# Altium project SmartMeter-new.PrjPCB (part 2 of 2)

## Sheet Sheet2-new.SchDoc: SMART METER Main Board
size A3; SheetNumber: 2
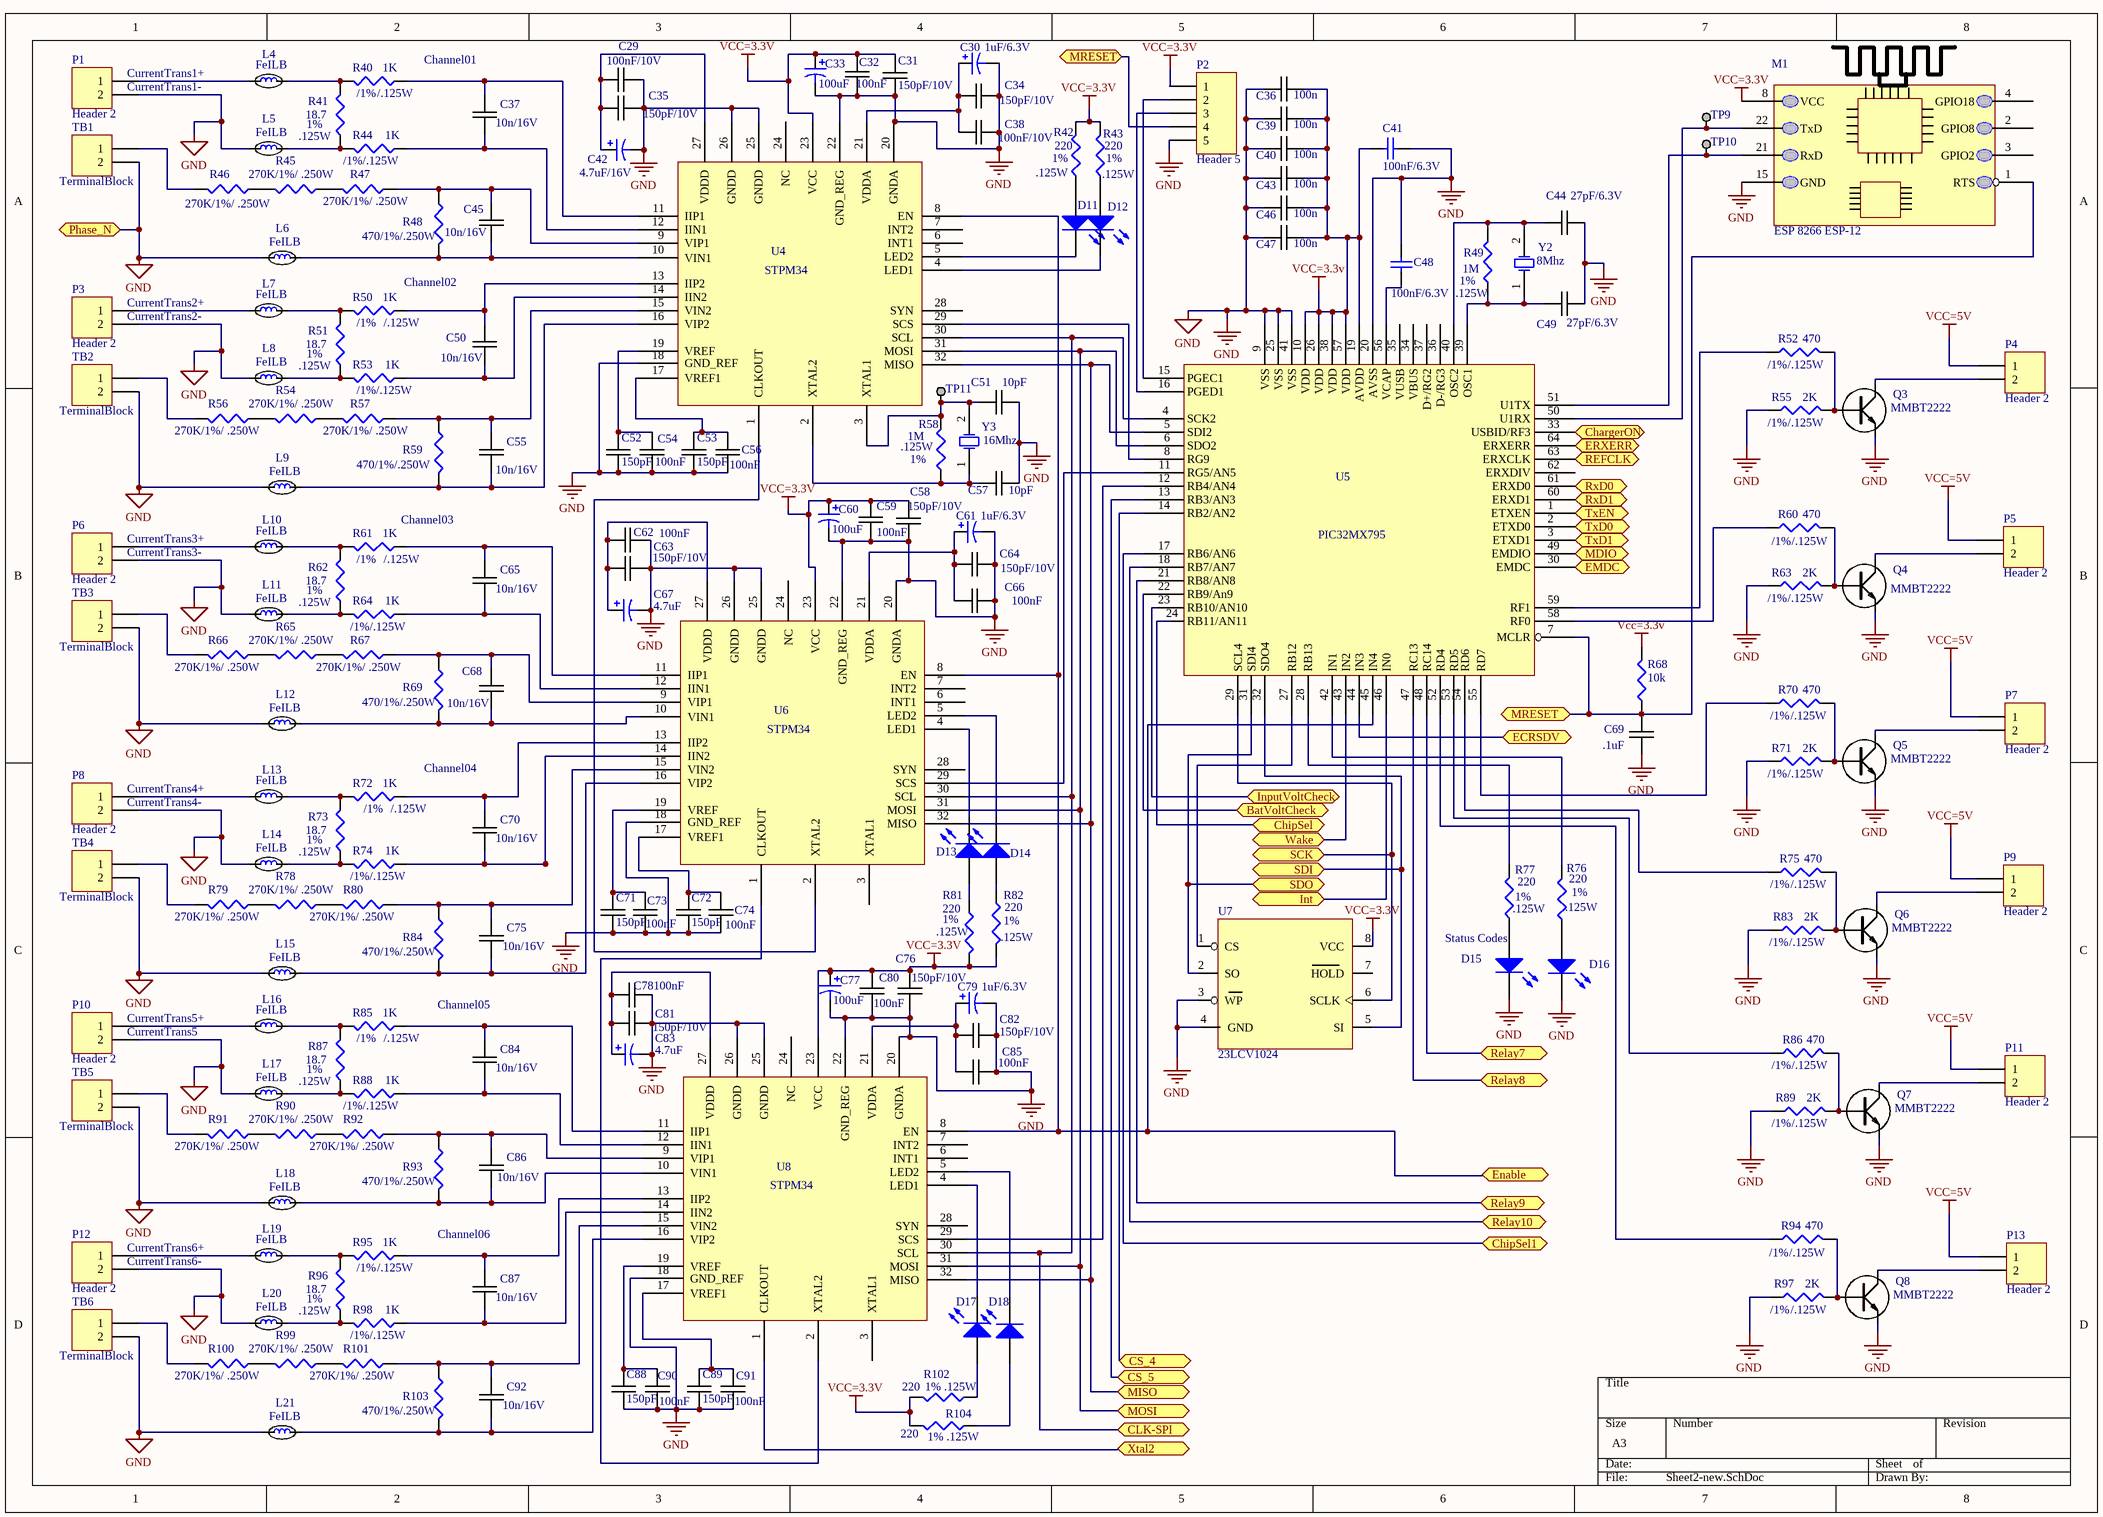
[diagram p1: Sheet2-new.SchDoc]

### Parts
C29  100nF/10V  [0402C-GENERIC]
C30  1uF/6.3V  [0402C-GENERIC]
C31  150pF/10V  [0402C-GENERIC]
C32  100nF  [0402C-GENERIC]
C33  100uF  [100uF/10V]
C34  150pF/10V  [0402C-GENERIC]
C35  150pF/10V  [0402C-GENERIC]
C36  100n  [0805C-TBD]
C37  10n/16V  [0402C-GENERIC]
C38  100nF/10V  [0402C-GENERIC]
C39  100n  [0805C-TBD]
C40  100n  [0805C-TBD]
C41  100nF/6.3V  [0805C-GENERIC]
C42  4.7uF/16V  [0805C-GENERIC]
C43  100n  [0805C-TBD]
C44  27pF/6.3V  [0603C-TBD]
C45  10n/16V  [0402C-GENERIC]
C46  100n  [0805C-TBD]
C47  100n  [0805C-TBD]
C48  100nF/6.3V  [0805C-GENERIC]
C49  27pF/6.3V  [0603C-TBD]
C50  10n/16V  [0402C-GENERIC]
C51  10pF  [0805C-TBD]
C52  150pF  [0402C-GENERIC]
C53  150pF  [0402C-GENERIC]
C54  100nF  [0402C-GENERIC]
C55  10n/16V  [0402C-GENERIC]
C56  100nF  [0402C-GENERIC]
C57  10pF  [0805C-TBD]
C58  150pF/10V  [0402C-GENERIC]
C59  100nF  [0402C-GENERIC]
C60  100uF  [100uF/10V]
C61  1uF/6.3V  [0402C-GENERIC]
C62  100nF  [0402C-GENERIC]
C63  150pF/10V  [0402C-GENERIC]
C64  150pF/10V  [0402C-GENERIC]
C65  10n/16V  [0402C-GENERIC]
C66  100nF  [0402C-GENERIC]
C67  4.7uF  [0805C-GENERIC]
C68  10n/16V  [0402C-GENERIC]
C69  .1uF  [0805C-TBD]
C70  10n/16V  [0402C-GENERIC]
C71  150pF  [0402C-GENERIC]
C72  150pF  [0402C-GENERIC]
C73  100nF  [0402C-GENERIC]
C74  100nF  [0402C-GENERIC]
C75  10n/16V  [0402C-GENERIC]
C76  150pF/10V  [0402C-GENERIC]
C77  100uF  [100uF/10V]
C78  100nF  [0402C-GENERIC]
C79  1uF/6.3V  [0402C-GENERIC]
C80  100nF  [0402C-GENERIC]
C81  150pF/10V  [0402C-GENERIC]
C82  150pF/10V  [0402C-GENERIC]
C83  4.7uF  [0805C-GENERIC]
C84  10n/16V  [0402C-GENERIC]
C85  100nF  [0402C-GENERIC]
C86  10n/16V  [0402C-GENERIC]
C87  10n/16V  [0402C-GENERIC]
C88  150pF  [0402C-GENERIC]
C89  150pF  [0402C-GENERIC]
C90  100nF  [0402C-GENERIC]
C91  100nF  [0402C-GENERIC]
C92  10n/16V  [0402C-GENERIC]
D11  LED2  [LED-SM]  (value not drawn)
D12  LED2  [LED-SM]  (value not drawn)
D13  LED2  [LED-SM]  (value not drawn)
D14  LED2  [LED-SM]  (value not drawn)
D15  LED2  [LED-SM]  (value not drawn)
D16  LED2  [LED-SM]  (value not drawn)
D17  LED2  [LED-SM]  (value not drawn)
D18  LED2  [LED-SM]  (value not drawn)
L4  FeILB  [0603C-TBD]
L5  FeILB  [0603C-TBD]
L6  FeILB  [0603C-TBD]
L7  FeILB  [0603C-TBD]
L8  FeILB  [0603C-TBD]
L9  FeILB  [0603R-0R]
L10  FeILB  [0603R-0R]
L11  FeILB  [0603C-TBD]
L12  FeILB  [0603R-0R]
L13  FeILB  [0603R-0R]
L14  FeILB  [0603C-TBD]
L15  FeILB  [0603C-TBD]
L16  FeILB  [0603C-TBD]
L17  FeILB  [0603R-0R]
L18  FeILB  [0603C-TBD]
L19  FeILB  [0603C-TBD]
L20  FeILB  [0603R-0R]
L21  FeILB  [0603C-TBD]
M1  ESP 8266 ESP-12  [PCBComponent_1 - duplicate]
P1  Header 2  [BG090-header]
P2  Header 5  [HDR1X5]
P3  Header 2  [BG090-header]
P4  Header 2  [BG090-header]
P5  Header 2  [BG090-header]
P6  Header 2  [BG090-header]
P7  Header 2  [BG090-header]
P8  Header 2  [BG090-header]
P9  Header 2  [BG090-header]
P10  Header 2  [BG090-header]
P11  Header 2  [BG090-header]
P12  Header 2  [BG090-header]
P13  Header 2  [BG090-header]
Q3  MMBT2222  [MMBT2222]
Q4  MMBT2222  [MMBT2222]
Q5  MMBT2222  [MMBT2222]
Q6  MMBT2222  [MMBT2222]
Q7  MMBT2222  [MMBT2222]
Q8  MMBT2222  [MMBT2222]
R40  1K  [0805C-GENERIC]
R41  18.7  [0805R-10]
R42  220  [0805C-GENERIC]
R43  220  [0805C-GENERIC]
R44  1K  [0805C-GENERIC]
R45  270K/1%/ .250W  [1210R-GENERIC]
R46  270K/1%/ .250W  [1210R-GENERIC]
R47  270K/1%/ .250W  [1210R-GENERIC]
R48  470/1%/.250W  [1206FB-GENERIC]
R49  1M  [0805R-12]
R50  1K  [0805C-GENERIC]
R51  18.7  [0805R-10]
R52  470  [0805R-39]
R53  1K  [0805C-GENERIC]
R54  270K/1%/ .250W  [1210R-GENERIC]
R55  2K  [0805R-180]
R56  270K/1%/ .250W  [1210R-GENERIC]
R57  270K/1%/ .250W  [1210R-GENERIC]
R58  1M  [0805FB-GENERIC]
R59  470/1%/.250W  [1206FB-GENERIC]
R60  470  [0805R-39]
R61  1K  [0805C-GENERIC]
R62  18.7  [0805R-10]
R63  2K  [0805R-180]
R64  1K  [0805C-GENERIC]
R65  270K/1%/ .250W  [1210R-GENERIC]
R66  270K/1%/ .250W  [1210R-GENERIC]
R67  270K/1%/ .250W  [1210R-GENERIC]
R68  10k  [0805R-27]
R69  470/1%/.250W  [1206FB-GENERIC]
R70  470  [0805R-39]
R71  2K  [0805R-180]
R72  1K  [0805C-GENERIC]
R73  18.7  [0805R-10]
R74  1K  [0805C-GENERIC]
R75  470  [0805R-39]
R76  220  [0805R-120]
R77  220  [0805R-12]
R78  270K/1%/ .250W  [1210R-GENERIC]
R79  270K/1%/ .250W  [1210R-GENERIC]
R80  270K/1%/ .250W  [1210R-GENERIC]
R81  220  [0805R-10]
R82  220  [0805R-10]
R83  2K  [0805R-180]
R84  470/1%/.250W  [1206FB-GENERIC]
R85  1K  [0805C-GENERIC]
R86  470  [0805R-39]
R87  18.7  [0805R-10]
R88  1K  [0805C-GENERIC]
R89  2K  [0805R-180]
R90  270K/1%/ .250W  [1210R-GENERIC]
R91  270K/1%/ .250W  [1210R-GENERIC]
R92  270K/1%/ .250W  [1210R-GENERIC]
R93  470/1%/.250W  [1206FB-GENERIC]
R94  470  [0805R-39]
R95  1K  [0805C-GENERIC]
R96  18.7  [0805R-10]
R97  2K  [0805R-180]
R98  1K  [0805C-GENERIC]
R99  270K/1%/ .250W  [1210R-GENERIC]
R100  270K/1%/ .250W  [1210R-GENERIC]
R101  270K/1%/ .250W  [1210R-GENERIC]
R102  220  [0805R-10]
R103  470/1%/.250W  [1206FB-GENERIC]
R104  220  [0805R-10]
TB1  TerminalBlock  [Terminal Block 2x5mm]
TB2  TerminalBlock  [Terminal Block 2x5mm]
TB3  TerminalBlock  [Terminal Block 2x5mm]
TB4  TerminalBlock  [Terminal Block 2x5mm]
TB5  TerminalBlock  [Terminal Block 2x5mm]
TB6  TerminalBlock  [Terminal Block 2x5mm]
TP9  TESTPOINT  [TESTPOINT]  (value not drawn)
TP10  TESTPOINT  [TESTPOINT]  (value not drawn)
TP11  TESTPOINT  [TESTPOINT]  (value not drawn)
U4  STPM34  [32M1-A_L]
U5  PIC32MX795  [TQFP-PT64_N]
U6  STPM34  [32M1-A_L]
U7  23LCV1024  [SO8_L]
U8  STPM34  [32M1-A_L]
Y2  8Mhz  [CeramicResonator8-16MHZ]
Y3  16Mhz  [CeramicResonator8-16MHZ]

### Ports
BatVoltCheck, ChargerON, ChipSel, ChipSel1, CLK-SPI, CS_4, CS_5, ECRSDV, EMDC, Enable, ERXERR, InputVoltCheck, Int, MDIO, MISO, MOSI, MRESET, Phase_N, REFCLK, Relay7, Relay8, Relay9, Relay10, RxD0, RxD1, SCK, SDI, SDO, TxD0, TxD1, TxEN, Wake, Xtal2

### Nets
GND: C29.1 C30.2 C31.2 C32.2 C33.2 C34.2 C35.2 C36.2 C38.1 C39.2 C40.2 C41.2 C42.2 C43.2 C44.2 C46.2 C47.2 C48.2 C49.2 C51.2 C52.2 C53.2 C54.2 C56.2 C57.2 C58.2 C59.1 C60.2 C61.2 C62.2 C63.2 C64.2 C66.2 C67.2 C69.1 C71.2 C72.2 C73.2 C74.1 C76.2 C77.2 C78.2 C79.2 C80.2 C81.2 C82.2 C83.2 C85.2 C88.2 C89.2 C90.2 C91.2 D15.2(K) D16.2(K) L5.1 L6.1 L8.1 L9.1 L11.1 L12.1 L14.1 L15.1 L17.1 L18.1 L20.1 L21.1 M1.15(GND) P1.2 P2.5 P3.2 P6.2 P8.2 P10.2 P12.2 Q3.E Q4.E Q5.E Q6.E Q7.E Q8.E R55.1 R63.1 R71.1 R83.1 R89.1 R97.1 TB1.2 TB2.2 TB3.2 TB4.2 TB5.2 TB6.2 U4.18(GND_REF) U4.20(GNDA) U4.22(GND_REG) U4.25(GNDD) U4.26(GNDD) U5.9(VSS) U5.20(AVSS) U5.25(VSS) U5.41(VSS) U6.18(GND_REF) U6.20(GNDA) U6.22(GND_REG) U6.25(GNDD) U6.26(GNDD) U7.3(WP) U7.4(GND) U8.18(GND_REF) U8.20(GNDA) U8.22(GND_REG) U8.25(GNDD) U8.26(GNDD) ; port Phase_N
VCC=3.3V: C31.1 C32.1 C33.1 C36.1 C39.1 C40.1 C41.1 C43.1 C46.1 C47.1 C58.1 C59.2 C60.1 C76.1 C77.1 C80.1 M1.8(VCC) P2.1 R42.2 R43.2 R68.2 R81.2 R82.2 R102.2 R104.2 U4.23(VCC) U5.10(VDD) U5.19(AVDD) U5.26(VDD) U5.38(VDD) U5.57(VDD) U6.23(VCC) U7.8(VCC) U8.23(VCC)
VCC=5V: P4.1 P5.1 P7.1 P9.1 P11.1 P13.1
NetC29_2: C29.2 C35.1 C42.1 U4.27(VDDD)
NetC30_1: C30.1 C34.1 C38.2 U4.21(VDDA)
NetC37_1: C37.1 R44.1 U4.12(IIN1)
NetC37_2: C37.2 R40.1 U4.11(IIP1)
NetC44_1: C44.1 R49.2 U5.40(OSC2) Y2.2(OSC2)
NetC45_1: C45.1 L6.2 R48.2 U4.10(VIN1)
NetC45_2: C45.2 R47.1 R48.1 U4.9(VIP1)
NetC48_1: C48.1 U5.56(VCAP)
NetC49_1: C49.1 R49.1 U5.39(OSC1) Y2.1(OSC1)
NetC50_1: C50.1 R53.1 U4.14(IIN2)
NetC50_2: C50.2 R50.1 U4.13(IIP2)
NetC51_1: C51.1 R58.2 TP11.1 U4.3(XTAL1) Y3.2(OSC2)
NetC52_1: C52.1 C54.1 U4.19(VREF)
NetC53_1: C53.1 C56.1 U4.17(VREF1)
NetC55_1: C55.1 L9.2 R59.2 U4.16(VIP2)
NetC55_2: C55.2 R57.1 R59.1 U4.15(VIN2)
NetC57_1: C57.1 R58.1 U4.2(XTAL2) Y3.1(OSC1)
NetC61_1: C61.1 C64.1 C66.1 U6.21(VDDA)
NetC62_1: C62.1 C63.1 C67.1 U6.27(VDDD)
NetC65_1: C65.1 R64.1 U6.12(IIN1)
NetC65_2: C65.2 R61.1 U6.11(IIP1)
NetC68_1: C68.1 L12.2 R69.2 U6.10(VIN1)
NetC68_2: C68.2 R67.1 R69.1 U6.9(VIP1)
NetC69_2: C69.2 M1.1(RTS) P2.4 R68.1 U5.7(MCLR) ; port MRESET
NetC70_1: C70.1 R74.1 U6.14(IIN2)
NetC70_2: C70.2 R72.1 U6.13(IIP2)
NetC71_1: C71.1 C73.1 U6.19(VREF)
NetC72_1: C72.1 C74.2 U6.17(VREF1)
NetC75_1: C75.1 L15.2 R84.2 U6.16(VIP2)
NetC75_2: C75.2 R80.1 R84.1 U6.15(VIN2)
NetC78_1: C78.1 C81.1 C83.1 U8.27(VDDD)
NetC79_1: C79.1 C82.1 C85.1 U8.21(VDDA)
NetC84_1: C84.1 R88.1 U8.12(IIN1)
NetC84_2: C84.2 R85.1 U8.11(IIP1)
NetC86_1: C86.1 L18.2 R93.2 U8.10(VIN1)
NetC86_2: C86.2 R92.1 R93.1 U8.9(VIP1)
NetC87_1: C87.1 R98.1 U8.14(IIN2)
NetC87_2: C87.2 R95.1 U8.13(IIP2)
NetC88_1: C88.1 C90.1 U8.19(VREF)
NetC89_1: C89.1 C91.1 U8.17(VREF1)
NetC92_1: C92.1 L21.2 R103.2 U8.16(VIP2)
NetC92_2: C92.2 R101.1 R103.1 U8.15(VIN2)
NetD11_1: D11.1(A) R42.1
NetD11_2: D11.2(K) U4.5(LED2)
NetD12_1: D12.1(A) R43.1
NetD12_2: D12.2(K) U4.4(LED1)
NetD13_1: D13.1(A) R81.1
NetD13_2: D13.2(K) U6.4(LED1)
NetD14_1: D14.1(A) R82.1
NetD14_2: D14.2(K) U6.5(LED2)
NetD15_1: D15.1(A) R77.1
NetD16_1: D16.1(A) R76.1
NetD17_1: D17.1(A) R102.1
NetD17_2: D17.2(K) U8.4(LED1)
NetD18_1: D18.1(A) R104.1
NetD18_2: D18.2(K) U8.5(LED2)
NetL4_1: L4.1 P1.1
NetL4_2: L4.2 R40.2 R41.2
NetL5_2: L5.2 R41.1 R44.2
NetL7_1: L7.1 P3.1
NetL7_2: L7.2 R50.2 R51.2
NetL8_2: L8.2 R51.1 R53.2
NetL10_1: L10.1 P6.1
NetL10_2: L10.2 R61.2 R62.2
NetL11_2: L11.2 R62.1 R64.2
NetL13_1: L13.1 P8.1
NetL13_2: L13.2 R72.2 R73.2
NetL14_2: L14.2 R73.1 R74.2
NetL16_1: L16.1 P10.1
NetL16_2: L16.2 R85.2 R87.2
NetL17_2: L17.2 R87.1 R88.2
NetL19_1: L19.1 P12.1
NetL19_2: L19.2 R95.2 R96.2
NetL20_2: L20.2 R96.1 R98.2
NetM1_21: M1.21(RxD) TP10.1 U5.51(U1TX)
NetM1_22: M1.22(TxD) TP9.1 U5.50(U1RX)
NetM2_3: U5.43(IN2) ; port Wake
NetM2_4: U5.46(IN0) ; port Int
NetM2_5: U5.32(SDO4) U7.5(SI) ; port SDI
NetM2_6: U5.29(SCL4) U7.6(SCLK) ; port SCK
NetM2_7: U5.31(SDI4) U7.2(SO) ; port SDO
NetM2_8: U5.24(RB11/AN11) ; port ChipSel
NetP2_2: P2.2 U5.15(PGEC1)
NetP2_3: P2.3 U5.16(PGED1)
NetP4_2: P4.2 Q3.C
NetP5_2: P5.2 Q4.C
NetP7_2: P7.2 Q5.C
NetP9_2: P9.2 Q6.C
NetP11_2: P11.2 Q7.C
NetP13_2: P13.2 Q8.C
NetQ3_B: Q3.B R52.2 R55.2
NetQ4_B: Q4.B R60.2 R63.2
NetQ5_B: Q5.B R70.2 R71.2
NetQ6_B: Q6.B R75.2 R83.2
NetQ7_B: Q7.B R86.2 R89.2
NetQ8_B: Q8.B R94.2 R97.2
NetR3_1: U5.23(RB10/AN10) ; port InputVoltCheck
NetR12_1: U5.22(RB9/An9) ; port BatVoltCheck
NetR13_2: U5.33(USBID/RF3) ; port ChargerON
NetR22_1: U5.49(EMDIO) ; port MDIO
NetR29_2: U5.61(ERXD0) ; port RxD0
NetR30_2: U5.60(ERXD1) ; port RxD1
NetR31_2: U5.44(IN3) ; port ECRSDV
NetR32_2: U5.64(ERXERR) ; port ERXERR
NetR35_2: U5.63(ERXCLK) ; port REFCLK
NetR45_1: R45.1 R47.2
NetR45_2: R45.2 R46.1
NetR46_2: R46.2 TB1.1
NetR52_1: R52.1 U5.59(RF1)
NetR54_1: R54.1 R57.2
NetR54_2: R54.2 R56.1
NetR56_2: R56.2 TB2.1
NetR60_1: R60.1 U5.58(RF0)
NetR65_1: R65.1 R67.2
NetR65_2: R65.2 R66.1
NetR66_2: R66.2 TB3.1
NetR70_1: R70.1 U5.55(RD7)
NetR75_1: R75.1 U5.54(RD6)
NetR76_2: R76.2 U5.42(IN1)
NetR77_2: R77.2 U5.28(RB13)
NetR78_1: R78.1 R80.2
NetR78_2: R78.2 R79.1
NetR79_2: R79.2 TB4.1
NetR86_1: R86.1 U5.53(RD5)
NetR90_1: R90.1 R92.2
NetR90_2: R90.2 R91.1
NetR91_2: R91.2 TB5.1
NetR94_1: R94.1 U5.52(RD4)
NetR99_1: R99.1 R101.2
NetR99_2: R99.2 R100.1
NetR100_2: R100.2 TB6.1
NetR112_1: U5.48(RC14) ; port Relay7
NetR121_1: U5.47(RC13) ; port Relay8
NetR125_1: U5.21(RB8/AN8) ; port Relay9
NetR133_1: U5.18(RB7/AN7) ; port Relay10
NetU3_13: U5.30(EMDC) ; port EMDC
NetU3_16: U5.1(ETXEN) ; port TxEN
NetU3_17: U5.2(ETXD0) ; port TxD0
NetU3_18: U5.3(ETXD1) ; port TxD1
NetU4_1: U4.1(CLKOUT) U6.2(XTAL2)
NetU4_8: U4.8(EN) U5.45(IN4) U6.8(EN) U8.8(EN) ; port Enable
NetU4_29: U4.29(SCS) U5.8(RG9)
NetU4_30: U4.30(SCL) U5.4(SCK2) U6.30(SCL) U8.30(SCL) ; port CLK-SPI
NetU4_31: U4.31(MOSI) U5.6(SDO2) U6.31(MOSI) U8.31(MOSI) ; port MOSI
NetU4_32: U4.32(MISO) U5.5(SDI2) U6.32(MISO) U8.32(MISO) ; port MISO
NetU5_11: U5.11(RG5/AN5) U6.29(SCS)
NetU5_12: U5.12(RB4/AN4) U8.29(SCS)
NetU5_13: U5.13(RB3/AN3) ; port CS_5
NetU5_14: U5.14(RB2/AN2) ; port CS_4
NetU5_17: U5.17(RB6/AN6) ; port ChipSel1
NetU5_27: U5.27(RB12) U7.1(CS)
NetU6_1: U6.1(CLKOUT) U8.2(XTAL2)
NetU8_1: U8.1(CLKOUT) ; port Xtal2

Not connected (* = marked no-connect by the designer): M1 2(GPIO8) 3(GPIO2) 4(GPIO18); U4 6(INT1) 7(INT2) 24(NC) 28(SYN); U5 34(VBUS) 35(VUSB) 36(D-/RG3) 37(D+/RG2) 62(ERXDIV); U6 3(XTAL1) 6(INT1) 7(INT2) 24(NC) 28(SYN); U7 7(HOLD); U8 3(XTAL1) 6(INT1) 7(INT2) 24(NC) 28(SYN)

### Notes on the sheet
- (near P1) CurrentTrans1+
- (near P1) CurrentTrans1-
- (near R40) /1%
- (near R40) /.125W
- Channel01
- .125W
- 1%
- (near R44) /1%/.125W
- (near R42) .125W
- (near R42) 1%
- (near R43) .125W
- (near R43) 1%
- (near P3) CurrentTrans2+
- (near P3) CurrentTrans2-
- (near R50) /1%
- (near R50) /.125W
- Channel02
- (near R49) .125W
- (near R49) 1%
- (near R52) /1%
- (near R52) /.125W
- (near R53) /1%/.125W
- (near R58) .125W
- (near R55) /1%
- (near R55) /.125W
- (near R61) Channel03
- (near R58) 1%
- (near P6) CurrentTrans3+
- (near P6) CurrentTrans3-
- (near R61) /1%
- (near R61) /.125W
- (near R60) /1%
- (near R60) /.125W
- (near R64) /1%/.125W
- (near R63) /1%
- (near R63) /.125W
- (near R70) /1%
- (near R70) /.125W
- (near P8) CurrentTrans4+
- Channel04
- (near R71) /1%
- (near R71) /.125W
- (near P8) CurrentTrans4-
- (near R72) /1%
- (near R72) /.125W
- (near R74) /1%/.125W
- (near R81) 1%
- (near R82) 1%
- (near R77) .125W
- (near R77) 1%
- (near R76) .125W
- (near R76) 1%
- (near R75) /1%
- (near R75) /.125W
- (near R81) .125W
- (near R82) .125W
- Status Codes
- (near R83) /1%
- (near R83) /.125W
- (near P10) CurrentTrans5+
- (near P10) CurrentTrans5
- (near R85) /1%
- (near R85) /.125W
- Channel05
- (near R88) /1%/.125W
- (near R89) /1%
- (near R86) /1%
- (near R89) /.125W
- (near R86) /.125W
- (near P12) CurrentTrans6+
- (near P12) CurrentTrans6-
- (near R95) /1%
- (near R95) /.125W
- Channel06
- (near R94) /1%
- (near R94) /.125W
- (near R97) /1%
- (near R97) /.125W
- (near R98) /1%/.125W
- (near R102) 1%
- (near R102) .125W
- (near R104) 1%
- (near R104) .125W

### Library data of the parts
C29 C32 C38 C54 C56 C59 C62 C66 C73 C74 C78 C80 C85 C90 C91 = 0805C-18PF-50V-C0G-JOH: CAPACITOR 0805 CERAMIC; mfr PN: LMK105BJ104KV-F; Manufacturer: Taiyo Yuden; Mfr.PN#: CRM155R71H103KA880; Value: 100nF/16V; Suppl.PN#: 587-1227-1-ND; Supplier 1: Digi-Key; Supplier Part Number 1: 709-1171-2-ND; Package reference: 0805-TBD; Supplier: Digi-Key; smd: 0402; Price: .002
C30 C61 C79 = Cap Pol3: Polarized Capacitor (Surface Mount); Manufacturing: Murata; Mfr.PN#: GRM155R60J105KE19D; Suppl.PN#: 490-1320-1-ND; Published: 8-Jun-2000; LatestRevisionDate: 29-May-2009; LatestRevisionNote: IPC-7351 Footprint Added.; PackageReference: 0402; Publisher: Altium Limited; PackageDescription: Chip Capacitor; Value: 1Uf/6.3v; Supplier: Digi-Key; SMD: 0402; Price: .05
C31 C34 C35 C58 C63 C64 C76 C81 C82 = 0805C-18PF-50V-C0G-JOH: CAPACITOR 0805 CERAMIC; Manufacturer: Wurth Electronics; Mfr.PN#: 885012005014; Suppl.PN#: 732-7432-1-ND; Supplier 1: Digi-Key; Supplier Part Number 1: 709-1171-2-ND; Value: 150pF/10V; mfr PN: *; Package reference: 0805-TBD; Supplier: Digi-Key; smd: 0402; Price: .002
C33 C60 C77 = Cap Pol3: Polarized Capacitor (Surface Mount); Manufacturer: Nichicon; Mfr.PN#: PCG1A101MCL1GS; Value: 100uF/10v; Suppl.PN#: 493-4589-1-ND; Published: 8-Jun-2000; LatestRevisionDate: 29-May-2009; LatestRevisionNote: IPC-7351 Footprint Added.; PackageReference: C0805; Publisher: Altium Limited; PackageDescription: Chip Capacitor; Supplier: Digi-Key; SMD: 1206; Price: .065
C36 C39 C40 C43 C46 C47 = 0805C-18PF-50V-C0G-JOH: CAPACITOR 0805 CERAMIC; Manufacturer: Murata Electronnics; Mfr.PN#: GRM155R61A104KA01; Value: 10n; Suppl.PN#: 490-1318-2-ND; Pprice: 0.0021; Supplier 1: Digi-Key; Supplier Part Number 1: 709-1171-2-ND; mfr PN: *; Package reference: 0805-TBD; Supplier: Digi-Key; SMD: 0402
C37 C45 C50 C55 C65 C68 C70 C75 C84 C86 C87 C92 = 0805C-18PF-50V-C0G-JOH: CAPACITOR 0805 CERAMIC; Manufacturer: Murata Electronics; Mfr.PN#: GRM155R71C103KA01D; Value: 10n; Suppl.PN#: 490-1313-1-ND; Supplier 1: Digi-Key; Supplier Part Number 1: 709-1171-2-ND; mfr PN: *; Package reference: 0805-TBD; Supplier: Digi-Key; smd: 0402; Price: .002
C41 C48 = Cap: Capacitor; Manufacturer: Kemet; Mfr.PN#: C0805C104K9RACTU; Value: 100n; Suppl.PN#: 399-9155-1-ND; Published: 8-Jun-2000; LatestRevisionDate: 17-Jul-2002; LatestRevisionNote: Re-released for DXP Platform.; PackageReference: 0402; Publisher: Altium Limited; PackageDescription: Radial Cap, Thru-Hole; 2 Leads; 0.3 in Pin Spacing; Supplier: Digi-Key; Price: .049; Footprint: 0603
C42 = Cap Pol3: Polarized Capacitor (Surface Mount); Manufacturer: Nichicon; Mfr.PN#: UZP1C4R7MCL1GB; Value: 4.7uF; Suppl.PN#: 493 10076-6-ND; Published: 8-Jun-2000; LatestRevisionDate: 29-May-2009; LatestRevisionNote: IPC-7351 Footprint Added.; PackageReference: C0805; Publisher: Altium Limited; PackageDescription: Chip Capacitor; Supplier: Digi-Key; SMD: 1206; Price: .065
C44 C49 = 0805C-18PF-50V-C0G-JOH: CAPACITOR 0805 CERAMIC; Manufacturer: Murata; Mfr.PN#: GJM0335C0J270JB01D; Suppliier: DigiKey; Suppl.PN#: 490-8067-1-ND; Supplier 1: Digi-Key; Supplier Part Number 1: 709-1171-2-ND
C51 C57 = 0805C-18PF-50V-C0G-JOH: CAPACITOR 0805 CERAMIC; Manufacturer: Kemet; Mfr.PN#: C0402C160J4GACTU; Suppl.PN#: 399-8947-2-ND; Supplier 1: Digi-Key; Supplier Part Number 1: 709-1171-2-ND; Supplier: Digi-Key; Price: .00987; SMD: 0402
C52 C53 C71 C72 C88 C89 = 0805C-18PF-50V-C0G-JOH: CAPACITOR 0805 CERAMIC; Manufacturer: Wurth Electronics; Mfr.PN#: 885012005014; Value: 150pF/10V; Suppl.PN#: 732-7432-1-ND; Supplier 1: Digi-Key; Supplier Part Number 1: 709-1171-2-ND; mfr PN: *; Package reference: 0805-TBD; Supplier: Digi-Key; smd: 0402; Price: .002
C67 C83 = Cap Pol3: Polarized Capacitor (Surface Mount); Manufacturer: Nichicon; Mfr.PN#: UZP1C4R7MCL1GB; Suppl.PN#: 493 10076-6-ND; Published: 8-Jun-2000; LatestRevisionDate: 29-May-2009; LatestRevisionNote: IPC-7351 Footprint Added.; PackageReference: C0805; Publisher: Altium Limited; PackageDescription: Chip Capacitor; Value: 4.7uF; Supplier: Digi-Key; SMD: 1206; Price: .065
C69 = 0805C-18PF-50V-C0G-JOH: CAPACITOR 0805 CERAMIC; Manufacturer: Samsung; Mfr.PN#: CL05B104KO5NNC; Suppl.PN#: 1276-1001-2-ND; Supplier 1: Digi-Key; Supplier Part Number 1: 709-1171-2-ND; Supplier: Digi-Key; Price: .00206; SMD: 0402
D11-D18 = LED2: Typical RED, GREEN, YELLOW, AMBER GaAs LED; Manufacturer: Lite-On Inc; Mfr.PN#: LTST-C191KGKT; Suppl.PN#: 160-1446-2-ND; Published: 8-Jun-2000; LatestRevisionDate: 17-Jul-2002; LatestRevisionNote: Re-released for DXP Platform.; PackageVersion: Feb-2002; PackageReference: 3.2X1.6X1.1; Publisher: Altium Limited; PackageDescription: SM LED; 2 Flat Leads; Supplier: Digi-Key; Price: .04
L4-L21 = FerrBeads/ILBB: Manufacturer: Brand Samsung; Mfr.PN#: C1M10J152NC; Suppl.PN#: 1276-6326-1-ND; Supplier: Digi-Key; Price: .027
M1 = ESP 8266
P1 P3-P13 = Header 2: Header, 2-Pin; Manufacturer: Clobal Connector technology Ltd; Mfr.PN#: BG090-02-A-H-P; LatestRevisionDate: 17-Jul-2002; LatestRevisionNote: Re-released for DXP Platform.; Publisher: Altium Limited; Mfr.WEB: www.globalconnectortechnology.com; Supplier: Clobal Connector technology Ltd; Suppl.PN#: BG090-02-A-H-P
P2 = Header 5: Header, 5-Pin; LatestRevisionDate: 17-Jul-2002; LatestRevisionNote: Re-released for DXP Platform.; Publisher: Altium Limited; Supplier: Optional depend of debugger
Q3-Q8 = MMBT2222: BC847 SMALL SIGNAL NPN TRANSISTOR; Manufacturer: Diodes  Inc.; Mfr.PN#: MMBT2222A-7-F; Suppl.PN#: MMBT2222A-FDICT-ND; Supplier 1: Digi-Key; Supplier Part Number 1: MMBT2222A-FDICT-ND; Supplier: Digi-Key; Package: SOT-323; Price: .03
R40 R44 R50 R53 R61 R64 R72 R74 R85 R88 R95 R98 = Res3: Resistor; Manufacturer: StackpoleElectronics; Mfr.PN#: RMCF0805FT1K00; Value: 1K/.125W/1%; Suppl.PN#: RMCF0805FT1K00TR-ND; Published: 8-Jun-2000; LatestRevisionDate: 29-May-2009; LatestRevisionNote: IPC-7351 Footprint Added.; PackageReference: J1-0603; Publisher: Altium Limited; PackageDescription: Chip Resistor; mfr PN: *; Supplier: Digi-Key; Price: .00266
R41 R51 R62 R73 R87 R96 = Res3: Resistor; Manufacturer: Vishay Pale; Mfr.PN#: CR0W12061R54FKEAHP; Value: 18.7 1%; Suppl.PN#: P18.7CCT-ND; Published: 8-Jun-2000; LatestRevisionDate: 29-May-2009; LatestRevisionNote: IPC-7351 Footprint Added.; PackageReference: J1-0603; Publisher: Altium Limited; PackageDescription: Chip Resistor; Supplier: Digi-Key; Price: .05; SMD: 0805
R42 R43 R76 R77 R81 R82 R102 R104 = Res3: Resistor; Manufacturer: Stackpole Electronics; Mfr.PN#: RMCF0805FT220R; Value: 1K 1%; Suppl.PN#: RMCF0805FT220RTR-ND; Published: 8-Jun-2000; LatestRevisionDate: 29-May-2009; LatestRevisionNote: IPC-7351 Footprint Added.; PackageReference: J1-0603; Publisher: Altium Limited; PackageDescription: Chip Resistor; manufacture P/N: *; Supplier: Digi-Key; Price: .0027
R45-R47 = Res3: Resistor; Manufacturer: Panasonic  Co; Mfr.PN#: RN73H2ETD2703F25; Value: 270k/ .5 W 1%; Suppl.PN#: 660-RN73H2ETD2703F25; Published: 8-Jun-2000; LatestRevisionDate: 29-May-2009; LatestRevisionNote: IPC-7351 Footprint Added.; PackageReference: 1210; Publisher: Altium Limited; PackageDescription: Chip Resistor; mfr PN: *; Package Reference: 1206; SMD: 1210; Price: .055
  R45 R46: Supplier: Mouser
  R47: Supplier: KOA Speer
R48 R59 R69 R84 R93 R103 = Res3: Resistor; Manufacturer: Panasonic Co; Mfr.PN#: ERJ-P06F6650V; Value: 470 1%/.250W; Suppl.PN#: RMCF1206FT470RDKR-ND; Published: 8-Jun-2000; LatestRevisionDate: 29-May-2009; LatestRevisionNote: IPC-7351 Footprint Added.; PackageReference: J1-0603; Publisher: Altium Limited; PackageDescription: Chip Resistor; Supplier: Digi-Key; Price: .02
  R48 R69 R84 R93 R103: SMD: 1206
  R59: SMD: 0805
R49 R58 = Res3: Resistor; Manufacturer: Stackpole Electronics; Mfr.PN#: RMCF0805FT1M00; Value: 1K 1%; Suppl.PN#: RMCF0805FT1M00TR-ND; Published: 8-Jun-2000; LatestRevisionDate: 29-May-2009; LatestRevisionNote: IPC-7351 Footprint Added.; PackageReference: J1-0603; Publisher: Altium Limited; PackageDescription: Chip Resistor; manufacture P/N: *; Supplier: Digi-Key; Price: .0027
R52 R60 R70 R75 R86 R94 = Res3: Resistor; Manufacturer: Stackpole electronics; Mfr.PN#: RMCF0805FT470R; Value: 470/.125W/1%; Suppl.PN#: RMCF0805FT470RtR-ND; Published: 8-Jun-2000; LatestRevisionDate: 29-May-2009; LatestRevisionNote: IPC-7351 Footprint Added.; PackageReference: J1-0603; Publisher: Altium Limited; PackageDescription: Chip Resistor; Supplier: Digi-Key; Price: .003
R54 R65-R67 R78-R80 R90-R92 R99-R101 = Res3: Resistor; Manufacturer: Panasonic  Co; Mfr.PN#: RN73H2ETD2703F25; Value: 175k/ .5 W 1%; Suppl.PN#: 660-RN73H2ETD2703F25; Published: 8-Jun-2000; LatestRevisionDate: 29-May-2009; LatestRevisionNote: IPC-7351 Footprint Added.; PackageReference: 1210; Publisher: Altium Limited; PackageDescription: Chip Resistor; mfr PN: *; Package Reference: 1206; Supplier: Mouser; SMD: 1210; Price: .055
R55 R63 R71 R83 R89 R97 = Res3: Resistor; Manufacturer: Stackpole Electronics; Mfr.PN#: RMCF0805FT2K00; Value: 2K/.125W/1%; Suppl.PN#: RMCF0805FT2K00-ND; Published: 8-Jun-2000; LatestRevisionDate: 29-May-2009; LatestRevisionNote: IPC-7351 Footprint Added.; PackageReference: J1-0603; Publisher: Altium Limited; PackageDescription: Chip Resistor; Supplier: Digi-Key; Price: .033
R56 = Res3: Resistor; Manufacturer: Panasonic  Co; Mfr.PN#: RN73H2ETD2703F25; Suppl.PN#: 660-RN73H2ETD2703F25; Published: 8-Jun-2000; LatestRevisionDate: 29-May-2009; LatestRevisionNote: IPC-7351 Footprint Added.; PackageReference: 1210; Publisher: Altium Limited; PackageDescription: Chip Resistor; Value: 270K/1%/.250; mfr PN: *; Package Reference: 1206; Supplier: Mouser; SMD: 1210; Price: .055
R57 = Res3: Resistor; Manufacturer: KOA Speer; Mfr.PN#: RN73H2ETD2703F25; Value: 175k/ .5 W 1%; Suppl.PN#: 660-RN73H2ETD2703F25; Published: 8-Jun-2000; LatestRevisionDate: 29-May-2009; LatestRevisionNote: IPC-7351 Footprint Added.; PackageReference: 1210; Publisher: Altium Limited; PackageDescription: Chip Resistor; mfr PN: *; Package Reference: 1206; Supplier: Mouser; SMD: 1210; Price: .055
R68 = Res3: Resistor; Value: 10k/.125W/1%; Suppl.PN#: RMCF0805FT10K0CT-ND; Published: 8-Jun-2000; LatestRevisionDate: 29-May-2009; LatestRevisionNote: IPC-7351 Footprint Added.; PackageReference: 0805; Publisher: Altium Limited; PackageDescription: Chip Resistor; Supplier: Digi-key
TB1-TB6 = Header 2: Header, 2-Pin; Suppl.PN#: ED2600-ND; LatestRevisionDate: 17-Jul-2002; LatestRevisionNote: Re-released for DXP Platform.; Publisher: Altium Limited; Supplier: Digi-Key
TP9-TP11 = TESTPOINT: TESTPOINT SCOPE GRABBER; Manufacturer Part Number: 5010; Manufacturer: Keystone Electronics; Reel: TH; Supplier 1: Digi-Key; Supplier Part Number 1: 5010K-ND
U4 U6 U8 = STPM34: Manufacturer: STMicroelectronic; Mfr.PN#: STPM34TR; Suppl.PN#: 497-14670-1-ND; Supplier: Digi-Key; Price: 1.16
U5 = PIC32MX534F064F: Manufacturer: Microchip; Mfr.PN#: PIC32MX795F512H-80I/PT; Suppl.PN#: 1778989; Supplier: Farnel; Price: 5.16
U7 = 23LCV1024: Manufacturer: Microchip; Mfr.PN#: 23LCV1024-I/SN; Suppl.PN#: 23LCV1024-I/SN-ND; Supplier: DigiKey
Y2 = XTAL: Crystal Oscillator; Manufacturer: AuxCorp/Kyocera Corp.; Mfr.PN#: ABLS-8.000MHZB4-T; Suppl.PN#: 478-2110-1-ND; Published: 8-Jun-2000; LatestRevisionDate: 17-Jul-2002; LatestRevisionNote: Re-released for DXP Platform.; PackageReference: PBRC-H; Publisher: Altium Limited; PackageDescription: Crystal, Thru-Hole; 2 Leads; Body 3.1 x 8.2 mm (Dia.xH); Supplier: Digi-Key; Price: .137
Y3 = XTAL: Crystal Oscillator; Manufacturer: Abracon; Mfr.PN#: ABLS3-16.000MHz-D4Y-T; Suppl.PN#: 1253-1084-2-ND; Published: 8-Jun-2000; LatestRevisionDate: 17-Jul-2002; LatestRevisionNote: Re-released for DXP Platform.; PackageReference: R38; Publisher: Altium Limited; PackageDescription: Crystal, Thru-Hole; 2 Leads; Body 3.1 x 8.2 mm (Dia.xH); Supplier: Digi-Key; Price: .288

## Sheet Sheet3-new.SchDoc
size A3; SheetNumber: 3
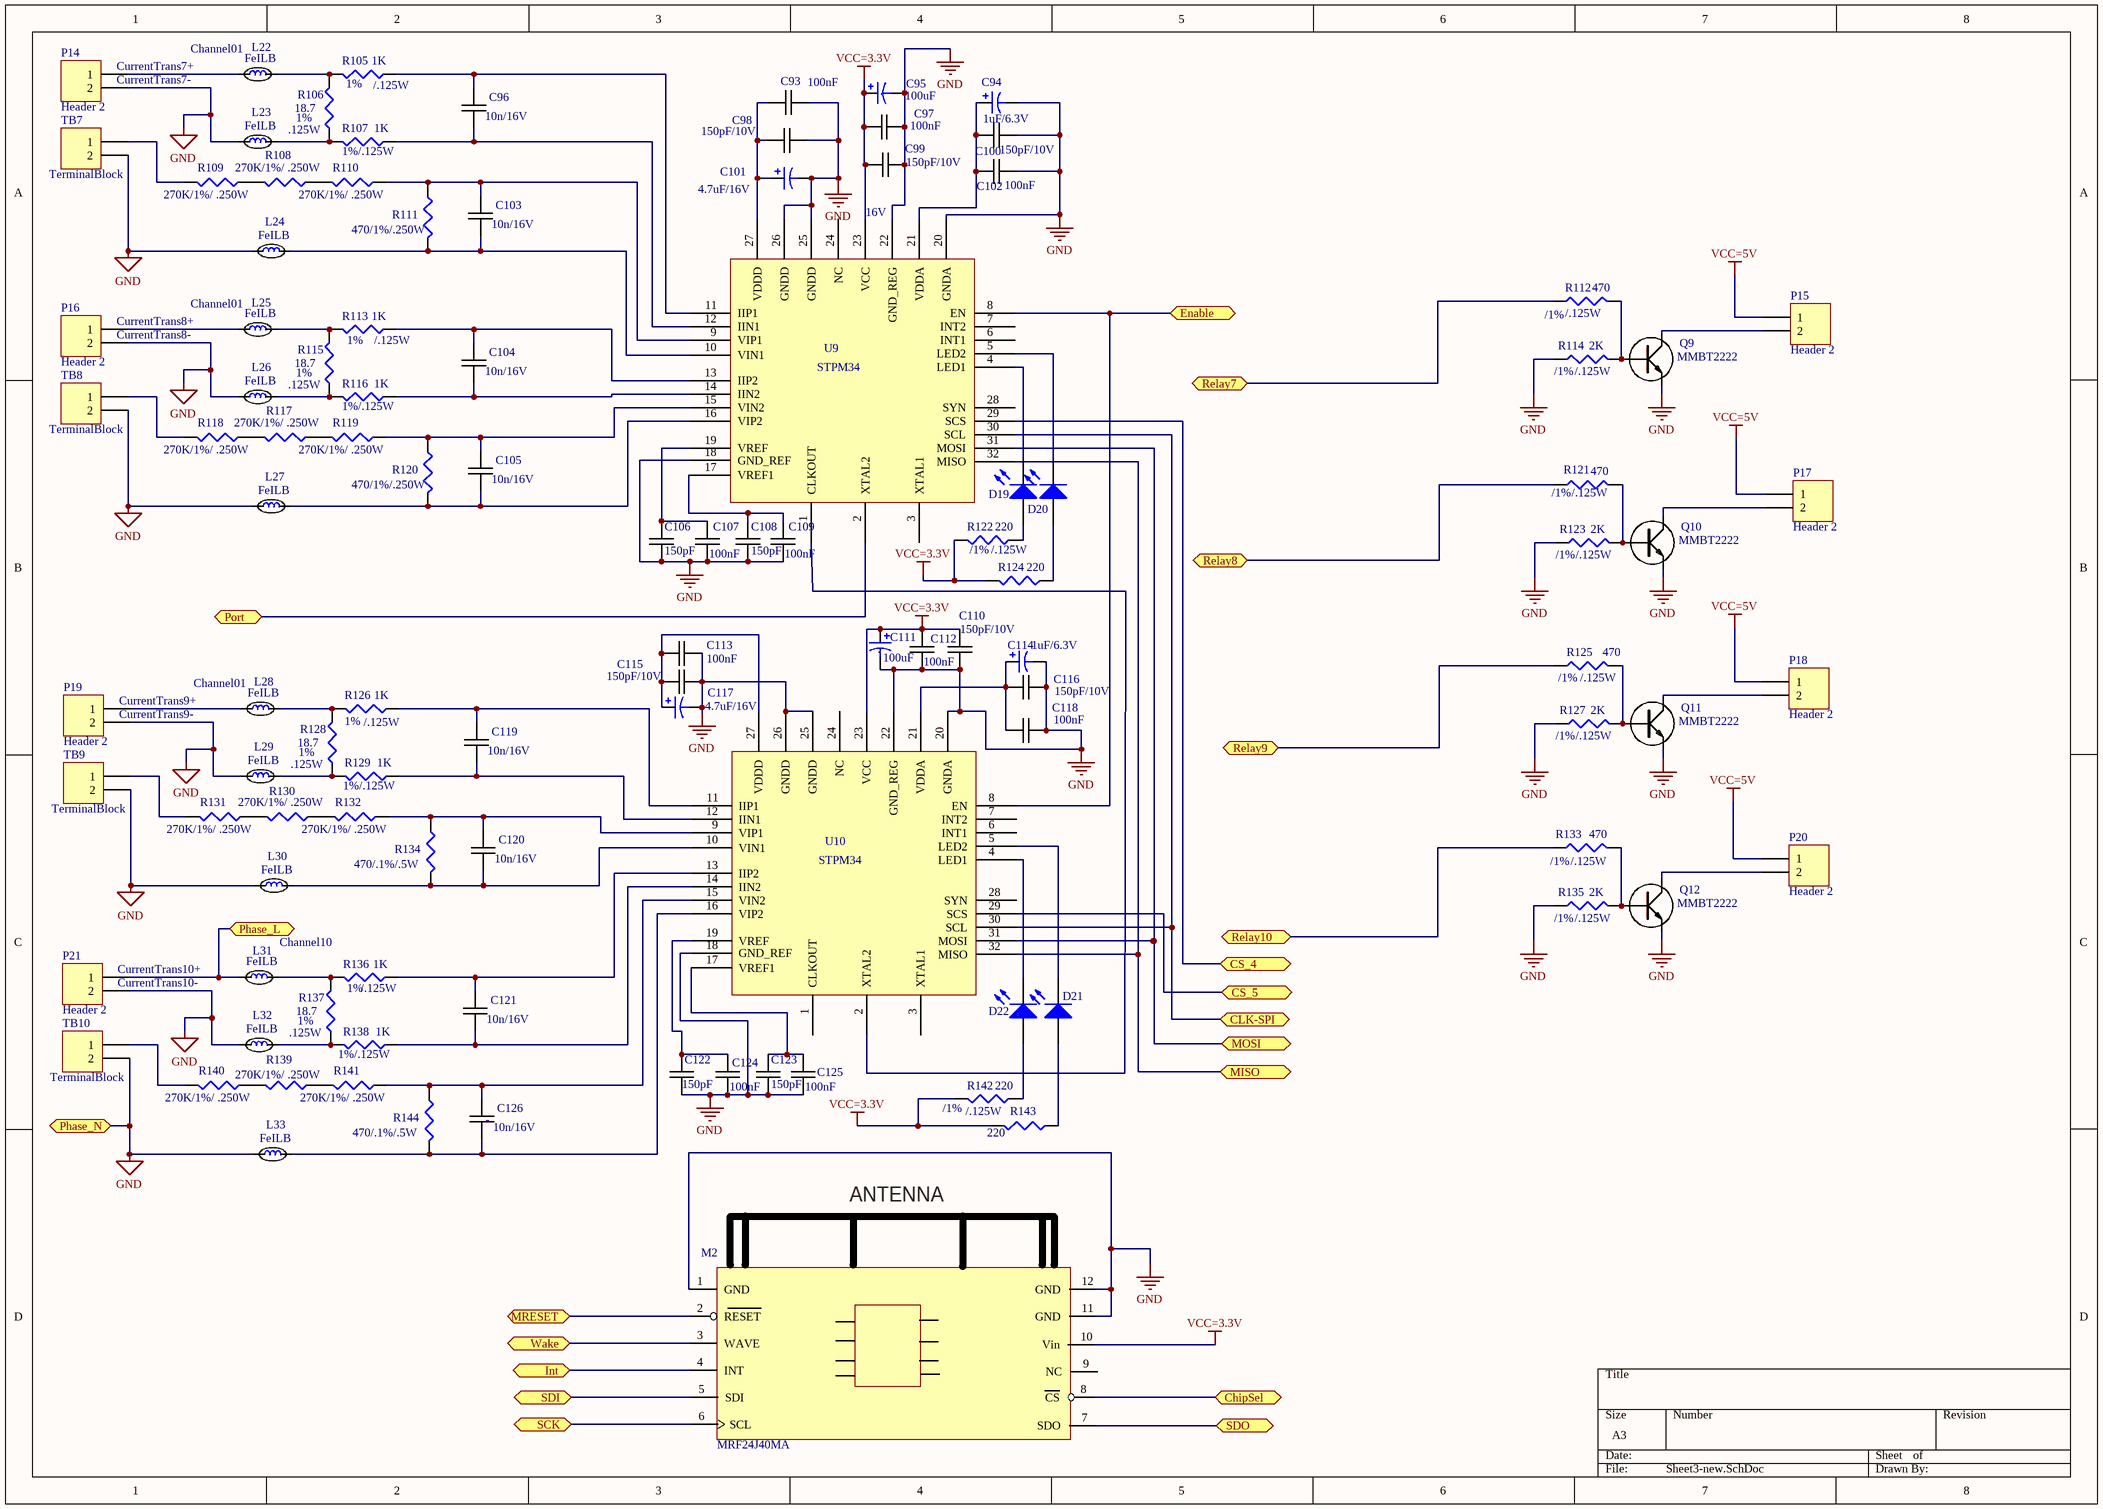
[diagram p2: Sheet3-new.SchDoc]

### Parts
C93  100nF  [0402C-GENERIC]
C94  1uF/6.3V  [0402C-GENERIC]
C95  100uF  [100uF/10V]
C96  10n/16V  [0402C-GENERIC]
C97  100nF  [0402C-GENERIC]
C98  150pF/10V  [0402C-GENERIC]
C99  150pF/10V  [0402C-GENERIC]
C100  150pF/10V  [0402C-GENERIC]
C101  4.7uF/16V  [0805C-GENERIC]
C102  100nF  [0402C-GENERIC]
C103  10n/16V  [0402C-GENERIC]
C104  10n/16V  [0402C-GENERIC]
C105  10n/16V  [0402C-GENERIC]
C106  150pF  [0402C-GENERIC]
C107  100nF  [0402C-GENERIC]
C108  150pF  [0402C-GENERIC]
C109  100nF  [0402C-GENERIC]
C110  150pF/10V  [0402C-GENERIC]
C111  100uF  [100uF/10V]
C112  100nF  [0402C-GENERIC]
C113  100nF  [0402C-GENERIC]
C114  1uF/6.3V  [0402C-GENERIC]
C115  150pF/10V  [0402C-GENERIC]
C116  150pF/10V  [0402C-GENERIC]
C117  4.7uF/16V  [0805C-GENERIC]
C118  100nF  [0402C-GENERIC]
C119  10n/16V  [0402C-GENERIC]
C120  10n/16V  [0402C-GENERIC]
C121  10n/16V  [0402C-GENERIC]
C122  150pF  [0402C-GENERIC]
C123  150pF  [0402C-GENERIC]
C124  100nF  [0402C-GENERIC]
C125  100nF  [0402C-GENERIC]
C126  10n/16V  [0402C-GENERIC]
D19  LED2  [LED-SM]  (value not drawn)
D20  LED2  [LED-SM]  (value not drawn)
D21  LED2  [LED-SM]  (value not drawn)
D22  LED2  [LED-SM]  (value not drawn)
L22  FeILB  [0603C-TBD]
L23  FeILB  [0603C-TBD]
L24  FeILB  [0603C-TBD]
L25  FeILB  [0603C-TBD]
L26  FeILB  [0603C-TBD]
L27  FeILB  [0603C-TBD]
L28  FeILB  [0603C-TBD]
L29  FeILB  [0603C-TBD]
L30  FeILB  [0603C-TBD]
L31  FeILB  [0603C-TBD]
L32  FeILB  [0603C-TBD]
L33  FeILB  [0603C-TBD]
M2  MRF24J40MA  [MRF24J40MA-zigBEE module]
P14  Header 2  [BG090-header]
P15  Header 2  [BG090-header]
P16  Header 2  [BG090-header]
P17  Header 2  [BG090-header]
P18  Header 2  [BG090-header]
P19  Header 2  [BG090-header]
P20  Header 2  [BG090-header]
P21  Header 2  [BG090-header]
Q9  MMBT2222  [MMBT2222]
Q10  MMBT2222  [MMBT2222]
Q11  MMBT2222  [MMBT2222]
Q12  MMBT2222  [MMBT2222]
R105  1K  [0805C-GENERIC]
R106  18.7  [0805R-10]
R107  1K  [0805C-GENERIC]
R108  270K/1%/ .250W  [1210R-GENERIC]
R109  270K/1%/ .250W  [1210R-GENERIC]
R110  270K/1%/ .250W  [1210R-GENERIC]
R111  470/1%/.250W  [1206FB-GENERIC]
R112  470  [0805R-39]
R113  1K  [0805C-GENERIC]
R114  2K  [0805R-180]
R115  18.7  [0805R-10]
R116  1K  [0805C-GENERIC]
R117  270K/1%/ .250W  [1210R-GENERIC]
R118  270K/1%/ .250W  [1210R-GENERIC]
R119  270K/1%/ .250W  [1210R-GENERIC]
R120  470/1%/.250W  [1206FB-GENERIC]
R121  470  [0805R-39]
R122  220  [0805C-GENERIC]
R123  2K  [0805R-180]
R124  220  [0805C-GENERIC]
R125  470  [0805R-39]
R126  1K  [0805C-GENERIC]
R127  2K  [0805R-180]
R128  18.7  [0805R-10]
R129  1K  [0805C-GENERIC]
R130  270K/1%/ .250W  [1210R-GENERIC]
R131  270K/1%/ .250W  [1210R-GENERIC]
R132  270K/1%/ .250W  [1210R-GENERIC]
R133  470  [0805R-39]
R134  470/.1%/.5W  [1210C-GENERIC]
R135  2K  [0805R-180]
R136  1K  [0805C-GENERIC]
R137  18.7  [0805R-10]
R138  1K  [0805C-GENERIC]
R139  270K/1%/ .250W  [1210R-GENERIC]
R140  270K/1%/ .250W  [1210R-GENERIC]
R141  270K/1%/ .250W  [1210R-GENERIC]
R142  220  [0805C-GENERIC]
R143  220  [0805C-GENERIC]
R144  470/.1%/.5W  [1210C-GENERIC]
TB7  TerminalBlock  [Terminal Block 2x5mm]
TB8  TerminalBlock  [Terminal Block 2x5mm]
TB9  TerminalBlock  [Terminal Block 2x5mm]
TB10  TerminalBlock  [Terminal Block 2x5mm]
U9  STPM34  [32M1-A_L]
U10  STPM34  [32M1-A_L]

### Ports
ChipSel, CLK-SPI, CS_4, CS_5, Enable, Int, MISO, MOSI, MRESET, Phase_L, Phase_N, Port, Relay7, Relay8, Relay9, Relay10, SCK, SDI, SDO, Wake

### Nets
GND: C93.2 C94.2 C95.2 C97.2 C98.2 C99.2 C100.1 C101.2 C102.2 C106.2 C107.2 C108.2 C109.2 C110.2 C111.2 C112.2 C113.2 C114.2 C115.2 C116.2 C117.2 C118.2 C122.2 C123.2 C124.2 C125.2 L23.1 L24.1 L26.1 L27.1 L29.1 L30.1 L32.1 L33.1 M2.1(GND) M2.11(GND) M2.12(GND) P14.2 P16.2 P19.2 P21.2 Q9.E Q10.E Q11.E Q12.E R114.1 R123.1 R127.1 R135.1 TB7.2 TB8.2 TB9.2 TB10.2 U9.18(GND_REF) U9.20(GNDA) U9.22(GND_REG) U9.25(GNDD) U9.26(GNDD) U10.18(GND_REF) U10.20(GNDA) U10.22(GND_REG) U10.25(GNDD) U10.26(GNDD) ; port Phase_N
VCC=3.3V: C95.1 C97.1 C99.1 C110.1 C111.1 C112.1 M2.10(Vin) R122.2 R124.2 R142.2 R143.2 U9.23(VCC) U10.23(VCC)
VCC=5V: P15.1 P17.1 P18.1 P20.1
NetC69_2: M2.2(RESET) ; port MRESET
NetC93_1: C93.1 C98.1 C101.1 U9.27(VDDD)
NetC94_1: C94.1 C100.2 C102.1 U9.21(VDDA)
NetC96_1: C96.1 R107.1 U9.12(IIN1)
NetC96_2: C96.2 R105.1 U9.11(IIP1)
NetC103_1: C103.1 L24.2 R111.2 U9.10(VIN1)
NetC103_2: C103.2 R110.1 R111.1 U9.9(VIP1)
NetC104_1: C104.1 R116.1 U9.14(IIN2)
NetC104_2: C104.2 R113.1 U9.13(IIP2)
NetC105_1: C105.1 L27.2 R120.2 U9.16(VIP2)
NetC105_2: C105.2 R119.1 R120.1 U9.15(VIN2)
NetC106_1: C106.1 C107.1 U9.19(VREF)
NetC108_1: C108.1 C109.1 U9.17(VREF1)
NetC113_1: C113.1 C115.1 C117.1 U10.27(VDDD)
NetC114_1: C114.1 C116.1 C118.1 U10.21(VDDA)
NetC119_1: C119.1 R129.1 U10.12(IIN1)
NetC119_2: C119.2 R126.1 U10.11(IIP1)
NetC120_1: C120.1 L30.2 R134.2 U10.10(VIN1)
NetC120_2: C120.2 R132.1 R134.1 U10.9(VIP1)
NetC121_1: C121.1 R138.1 U10.14(IIN2)
NetC121_2: C121.2 R136.1 U10.13(IIP2)
NetC122_1: C122.1 C124.1 U10.19(VREF)
NetC123_1: C123.1 C125.1 U10.17(VREF1)
NetC126_1: C126.1 L33.2 R144.2 U10.16(VIP2)
NetC126_2: C126.2 R141.1 R144.1 U10.15(VIN2)
NetD19_1: D19.1(A) R122.1
NetD19_2: D19.2(K) U9.4(LED1)
NetD20_1: D20.1(A) R124.1
NetD20_2: D20.2(K) U9.5(LED2)
NetD21_1: D21.1(A) R143.1
NetD21_2: D21.2(K) U10.5(LED2)
NetD22_1: D22.1(A) R142.1
NetD22_2: D22.2(K) U10.4(LED1)
NetF1_1: L31.1 P21.1 ; port Phase_L
NetL22_1: L22.1 P14.1
NetL22_2: L22.2 R105.2 R106.2
NetL23_2: L23.2 R106.1 R107.2
NetL25_1: L25.1 P16.1
NetL25_2: L25.2 R113.2 R115.2
NetL26_2: L26.2 R115.1 R116.2
NetL28_1: L28.1 P19.1
NetL28_2: L28.2 R126.2 R128.2
NetL29_2: L29.2 R128.1 R129.2
NetL31_2: L31.2 R136.2 R137.2
NetL32_2: L32.2 R137.1 R138.2
NetM2_3: M2.3(WAVE) ; port Wake
NetM2_4: M2.4(INT) ; port Int
NetM2_5: M2.5(SDI) ; port SDI
NetM2_6: M2.6(SCL) ; port SCK
NetM2_7: M2.7(SDO) ; port SDO
NetM2_8: M2.8(CS) ; port ChipSel
NetP15_2: P15.2 Q9.C
NetP17_2: P17.2 Q10.C
NetP18_2: P18.2 Q11.C
NetP20_2: P20.2 Q12.C
NetQ9_B: Q9.B R112.2 R114.2
NetQ10_B: Q10.B R121.2 R123.2
NetQ11_B: Q11.B R125.2 R127.2
NetQ12_B: Q12.B R133.2 R135.2
NetR108_1: R108.1 R110.2
NetR108_2: R108.2 R109.1
NetR109_2: R109.2 TB7.1
NetR112_1: R112.1 ; port Relay7
NetR117_1: R117.1 R119.2
NetR117_2: R117.2 R118.1
NetR118_2: R118.2 TB8.1
NetR121_1: R121.1 ; port Relay8
NetR125_1: R125.1 ; port Relay9
NetR130_1: R130.1 R132.2
NetR130_2: R130.2 R131.1
NetR131_2: R131.2 TB9.1
NetR133_1: R133.1 ; port Relay10
NetR139_1: R139.1 R141.2
NetR139_2: R139.2 R140.1
NetR140_2: R140.2 TB10.1
NetU4_8: U9.8(EN) U10.8(EN) ; port Enable
NetU4_30: U9.30(SCL) U10.30(SCL) ; port CLK-SPI
NetU4_31: U9.31(MOSI) U10.31(MOSI) ; port MOSI
NetU4_32: U9.32(MISO) U10.32(MISO) ; port MISO
NetU5_13: U10.29(SCS) ; port CS_5
NetU5_14: U9.29(SCS) ; port CS_4
NetU9_1: U9.1(CLKOUT) U10.2(XTAL2)
NetU9_2: U9.2(XTAL2) ; port Port

Not connected (* = marked no-connect by the designer): M2 9(NC); U9 3(XTAL1) 6(INT1) 7(INT2) 24(NC) 28(SYN); U10 1(CLKOUT) 3(XTAL1) 6(INT1) 7(INT2) 24(NC) 28(SYN)

### Notes on the sheet
- (near P14) CurrentTrans7+
- (near P14) CurrentTrans7-
- (near L22) Channel01
- (near R105) 1%
- (near R105) /.125W
- .125W
- 1%
- (near R107) 1%/.125W
- 16V
- (near L25) Channel01
- (near R112) /1%
- (near R112) /.125W
- (near P16) CurrentTrans8+
- (near P16) CurrentTrans8-
- (near R113) 1%
- (near R113) /.125W
- (near R114) /1%
- (near R114) /.125W
- (near R116) 1%/.125W
- (near R121) /1%
- (near R121) /.125W
- (near R122) /1%
- (near R122) /.125W
- (near R123) /1%
- (near R123) /.125W
- (near P19) CurrentTrans9+
- (near P19) CurrentTrans9-
- (near L28) Channel01
- (near R125) /1%
- (near R125) /.125W
- (near R129) 1%/.125W
- (near R126) /.125W
- (near R127) /1%
- (near R127) /.125W
- (near R133) /1%
- (near R135) /1%
- (near R133) /.125W
- (near R135) /.125W
- (near P21) CurrentTrans10+
- (near P21) CurrentTrans10-
- Channel10
- (near R136) 1%
- (near R136) /.125W
- (near R138) 1%/.125W
- (near R142) /1%
- /.125W
- (in symbol MRF24J40MA) ANTENNA

### Library data of the parts
C93 C97 C102 C107 C109 C112 C113 C118 C124 C125 = 0805C-18PF-50V-C0G-JOH: as C29 on sheet Sheet2-new; Supplier 1: Digi-Key; Supplier Part Number 1: 709-1171-2-ND; Package reference: 0805-TBD; Supplier: Digi-Key; smd: 0402; Price: .002
C94 C114 = Cap Pol3: as C30 on sheet Sheet2-new; Published: 8-Jun-2000; LatestRevisionDate: 29-May-2009; LatestRevisionNote: IPC-7351 Footprint Added.; PackageReference: 0402; Publisher: Altium Limited; PackageDescription: Chip Capacitor; Value: 1Uf/6.3v; Supplier: Digi-Key; SMD: 0402; Price: .05
C95 C111 = Cap Pol3: as C33 on sheet Sheet2-new; Published: 8-Jun-2000; LatestRevisionDate: 29-May-2009; LatestRevisionNote: IPC-7351 Footprint Added.; PackageReference: C0805; Publisher: Altium Limited; PackageDescription: Chip Capacitor; Supplier: Digi-Key; SMD: 1206; Price: .065
C96 C103-C105 C119-C121 C126 = 0805C-18PF-50V-C0G-JOH: as C37 on sheet Sheet2-new; Supplier 1: Digi-Key; Supplier Part Number 1: 709-1171-2-ND; mfr PN: *; Package reference: 0805-TBD; Supplier: Digi-Key; smd: 0402; Price: .002
C98-C100 C110 C115 C116 = 0805C-18PF-50V-C0G-JOH: as C31 on sheet Sheet2-new; Supplier 1: Digi-Key; Supplier Part Number 1: 709-1171-2-ND; Value: 150pF/10V; mfr PN: *; Package reference: 0805-TBD; Supplier: Digi-Key; smd: 0402; Price: .002
C101 C117 = Cap Pol3: Polarized Capacitor (Surface Mount); Manufacturer: Murata; Mfr.PN#: GRM21BR71A475KA73K; Value: 4.7uF; Suppl.PN#: 490-6479-1-ND; Published: 8-Jun-2000; LatestRevisionDate: 29-May-2009; LatestRevisionNote: IPC-7351 Footprint Added.; PackageReference: C0805; Publisher: Altium Limited; PackageDescription: Chip Capacitor; Supplier: Digi-Key; SMD: 1206; Price: .065
C106 C108 C122 C123 = 0805C-18PF-50V-C0G-JOH: as C52 on sheet Sheet2-new; Supplier 1: Digi-Key; Supplier Part Number 1: 709-1171-2-ND; mfr PN: *; Package reference: 0805-TBD; Supplier: Digi-Key; smd: 0402; Price: .002
D19-D22 = LED2: as D11 on sheet Sheet2-new; Published: 8-Jun-2000; LatestRevisionDate: 17-Jul-2002; LatestRevisionNote: Re-released for DXP Platform.; PackageVersion: Feb-2002; PackageReference: 3.2X1.6X1.1; Publisher: Altium Limited; PackageDescription: SM LED; 2 Flat Leads; Supplier: Digi-Key; Price: .04
L22-L33 = FerrBeads/ILBB: as L4 on sheet Sheet2-new; Supplier: Digi-Key; Price: .027
M2 = MRF24J40MA: Manufacturer: Microchip; Mfr.PN#: MRF24J40MDT-I/RM; Suppl.PN#: MRF24J40MDT-I/RMCT-ND; Supplier: Digi-Key; Price: 6.08
P14-P21 = Header 2: as P1 on sheet Sheet2-new; LatestRevisionDate: 17-Jul-2002; LatestRevisionNote: Re-released for DXP Platform.; Publisher: Altium Limited; Mfr.WEB: www.globalconnectortechnology.com; Supplier: Clobal Connector technology Ltd; Suppl.PN#: BG090-02-A-H-P
Q9-Q12 = MMBT2222: as Q3 on sheet Sheet2-new; Supplier 1: Digi-Key; Supplier Part Number 1: MMBT2222A-FDICT-ND; Supplier: Digi-Key; Package: SOT-323; Price: .03
R105 R107 R113 R116 R126 R129 R136 R138 = Res3: as R40 on sheet Sheet2-new; Published: 8-Jun-2000; LatestRevisionDate: 29-May-2009; LatestRevisionNote: IPC-7351 Footprint Added.; PackageReference: J1-0603; Publisher: Altium Limited; PackageDescription: Chip Resistor; mfr PN: *; Supplier: Digi-Key; Price: .00266
R106 R115 R128 R137 = Res3: as R41 on sheet Sheet2-new; Published: 8-Jun-2000; LatestRevisionDate: 29-May-2009; LatestRevisionNote: IPC-7351 Footprint Added.; PackageReference: J1-0603; Publisher: Altium Limited; PackageDescription: Chip Resistor; Supplier: Digi-Key; Price: .05; SMD: 0805
R108-R110 R117-R119 R130-R132 R139-R141 = Res3: as R54 on sheet Sheet2-new; Published: 8-Jun-2000; LatestRevisionDate: 29-May-2009; LatestRevisionNote: IPC-7351 Footprint Added.; PackageReference: 1210; Publisher: Altium Limited; PackageDescription: Chip Resistor; mfr PN: *; Package Reference: 1206; Supplier: Mouser; SMD: 1210; Price: .055
R111 R120 = Res3: as R48 on sheet Sheet2-new; Published: 8-Jun-2000; LatestRevisionDate: 29-May-2009; LatestRevisionNote: IPC-7351 Footprint Added.; PackageReference: J1-0603; Publisher: Altium Limited; PackageDescription: Chip Resistor; Supplier: Digi-Key; SMD: 1206; Price: .02
R112 R121 R125 R133 = Res3: as R52 on sheet Sheet2-new; Published: 8-Jun-2000; LatestRevisionDate: 29-May-2009; LatestRevisionNote: IPC-7351 Footprint Added.; PackageReference: J1-0603; Publisher: Altium Limited; PackageDescription: Chip Resistor; Supplier: Digi-Key; Price: .003
R114 R123 R127 R135 = Res3: as R55 on sheet Sheet2-new; Published: 8-Jun-2000; LatestRevisionDate: 29-May-2009; LatestRevisionNote: IPC-7351 Footprint Added.; PackageReference: J1-0603; Publisher: Altium Limited; PackageDescription: Chip Resistor; Supplier: Digi-Key; Price: .033
R122 R124 R142 R143 = Res3: as R42 on sheet Sheet2-new; Published: 8-Jun-2000; LatestRevisionDate: 29-May-2009; LatestRevisionNote: IPC-7351 Footprint Added.; PackageReference: J1-0603; Publisher: Altium Limited; PackageDescription: Chip Resistor; manufacture P/N: *; Supplier: Digi-Key; Price: .0027
R134 R144 = Res3: Resistor; Manufacturer: Panasonic Co; Mfr.PN#: ERJ-P06F6650V; Value: 3 .125W 1%; Suppl.PN#: P16076TR-ND; Published: 8-Jun-2000; LatestRevisionDate: 29-May-2009; LatestRevisionNote: IPC-7351 Footprint Added.; PackageReference: J1-0603; Publisher: Altium Limited; PackageDescription: Chip Resistor; Supplier: Digi-Key; SMD: 1210; Price: .02
TB7-TB10 = Header 2: Header, 2-Pin; Suppl.PN#: ED2600-ND; LatestRevisionDate: 17-Jul-2002; LatestRevisionNote: Re-released for DXP Platform.; Publisher: Altium Limited; Supplier: Digi-Key
U9 U10 = STPM34: as U4 on sheet Sheet2-new; Supplier: Digi-Key; Price: 1.16

## Nets that join several sheets
GND: Sheet1-new (44 pins), Sheet2-new (113 pins), Sheet3-new (63 pins)
VCC=3.3V: Sheet1-new (9 pins), Sheet2-new (34 pins), Sheet3-new (13 pins)
VCC=5V: Sheet1-new (10 pins), Sheet2-new (6 pins), Sheet3-new (P15.1 P17.1 P18.1 P20.1)
NetC69_2: Sheet2-new (5 pins), Sheet3-new (M2.2)
NetF1_1: Sheet1-new (F1.1), Sheet3-new (L31.1 P21.1)
NetM2_3: Sheet2-new (U5.43), Sheet3-new (M2.3)
NetM2_4: Sheet2-new (U5.46), Sheet3-new (M2.4)
NetM2_5: Sheet2-new (U5.32 U7.5), Sheet3-new (M2.5)
NetM2_6: Sheet2-new (U5.29 U7.6), Sheet3-new (M2.6)
NetM2_7: Sheet2-new (U5.31 U7.2), Sheet3-new (M2.7)
NetM2_8: Sheet2-new (U5.24), Sheet3-new (M2.8)
NetR3_1: Sheet1-new (R3.1 R7.2), Sheet2-new (U5.23)
NetR12_1: Sheet1-new (R12.1 R15.2), Sheet2-new (U5.22)
NetR13_2: Sheet1-new (R13.2), Sheet2-new (U5.33)
NetR22_1: Sheet1-new (R22.1 U3.12), Sheet2-new (U5.49)
NetR29_2: Sheet1-new (R29.2), Sheet2-new (U5.61)
NetR30_2: Sheet1-new (R30.2), Sheet2-new (U5.60)
NetR31_2: Sheet1-new (R31.2), Sheet2-new (U5.44)
NetR32_2: Sheet1-new (R32.2), Sheet2-new (U5.64)
NetR35_2: Sheet1-new (R35.2 U3.14), Sheet2-new (U5.63)
NetR112_1: Sheet2-new (U5.48), Sheet3-new (R112.1)
NetR121_1: Sheet2-new (U5.47), Sheet3-new (R121.1)
NetR125_1: Sheet2-new (U5.21), Sheet3-new (R125.1)
NetR133_1: Sheet2-new (U5.18), Sheet3-new (R133.1)
NetU3_13: Sheet1-new (U3.13), Sheet2-new (U5.30)
NetU3_16: Sheet1-new (U3.16), Sheet2-new (U5.1)
NetU3_17: Sheet1-new (U3.17), Sheet2-new (U5.2)
NetU3_18: Sheet1-new (U3.18), Sheet2-new (U5.3)
NetU4_8: Sheet2-new (U4.8 U5.45 U6.8 U8.8), Sheet3-new (U9.8 U10.8)
NetU4_30: Sheet2-new (U4.30 U5.4 U6.30 U8.30), Sheet3-new (U9.30 U10.30)
NetU4_31: Sheet2-new (U4.31 U5.6 U6.31 U8.31), Sheet3-new (U9.31 U10.31)
NetU4_32: Sheet2-new (U4.32 U5.5 U6.32 U8.32), Sheet3-new (U9.32 U10.32)
NetU5_13: Sheet2-new (U5.13), Sheet3-new (U10.29)
NetU5_14: Sheet2-new (U5.14), Sheet3-new (U9.29)